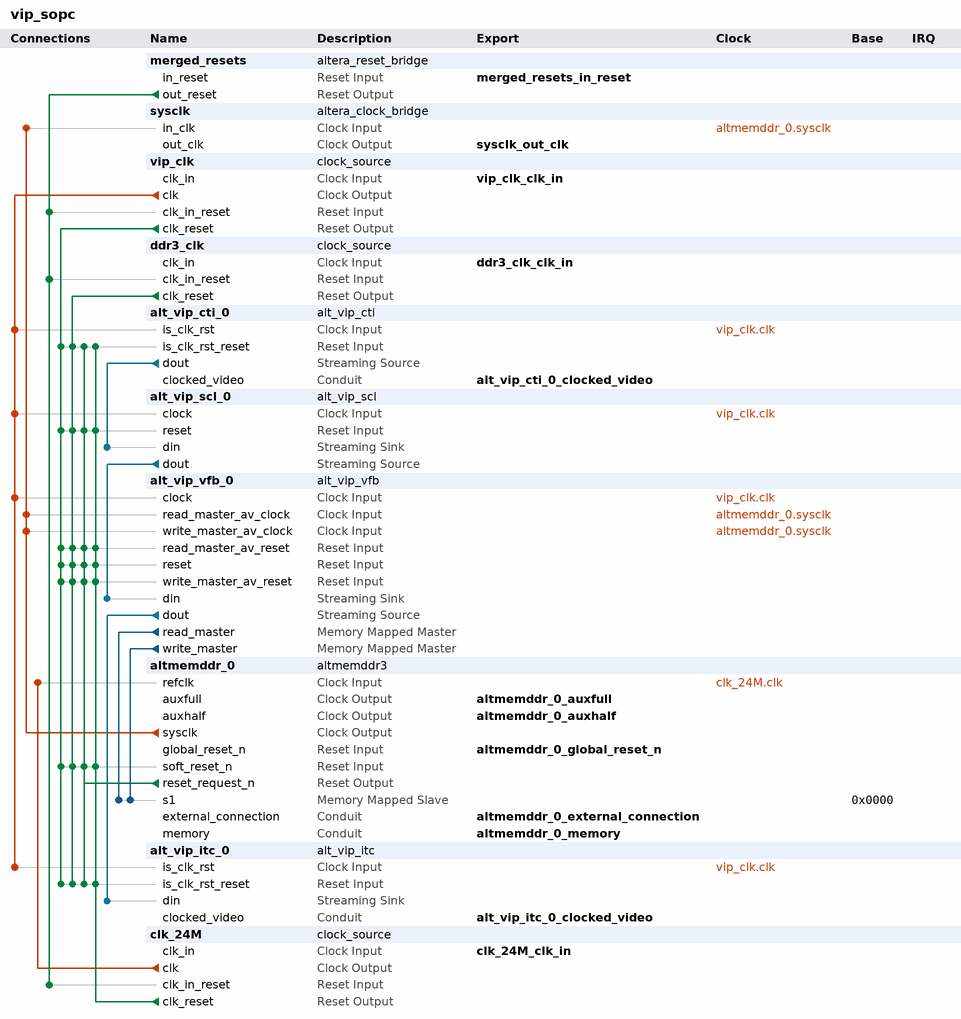
[diagram p0: system contents]
# Platform Designer (Qsys) system vip_sopc
# Parameters at their usual value, and those the tool derives, are not listed.
package require -exact qsys 12.0
create_system vip_sopc
set_project_property DEVICE_FAMILY {Stratix III}

add_instance merged_resets altera_reset_bridge 12.0
set_instance_parameter_value merged_resets ACTIVE_LOW_RESET 1
set_instance_parameter_value merged_resets SYNCHRONOUS_EDGES none

add_instance sysclk altera_clock_bridge 12.0
set_instance_parameter_value sysclk DERIVED_CLOCK_RATE 180000000
set_instance_parameter_value sysclk EXPLICIT_CLOCK_RATE 0

add_instance vip_clk clock_source 12.0
set_instance_parameter_value vip_clk clockFrequency 120000000

add_instance ddr3_clk clock_source 12.0
set_instance_parameter_value ddr3_clk clockFrequency 50000000

add_instance alt_vip_cti_0 alt_vip_cti 12.0
set_instance_parameter_value alt_vip_cti_0 FAMILY {Stratix III}
set_instance_parameter_value alt_vip_cti_0 BPS 8
set_instance_parameter_value alt_vip_cti_0 NUMBER_OF_COLOUR_PLANES 3
set_instance_parameter_value alt_vip_cti_0 COLOUR_PLANES_ARE_IN_PARALLEL 1
set_instance_parameter_value alt_vip_cti_0 SYNC_TO 0
set_instance_parameter_value alt_vip_cti_0 USE_EMBEDDED_SYNCS 0
set_instance_parameter_value alt_vip_cti_0 ADD_DATA_ENABLE_SIGNAL 0
set_instance_parameter_value alt_vip_cti_0 ACCEPT_COLOURS_IN_SEQ 0
set_instance_parameter_value alt_vip_cti_0 USE_STD 0
set_instance_parameter_value alt_vip_cti_0 STD_WIDTH 1
set_instance_parameter_value alt_vip_cti_0 GENERATE_ANC 0
set_instance_parameter_value alt_vip_cti_0 INTERLACED 0
set_instance_parameter_value alt_vip_cti_0 H_ACTIVE_PIXELS_F0 2048
set_instance_parameter_value alt_vip_cti_0 V_ACTIVE_LINES_F0 576
set_instance_parameter_value alt_vip_cti_0 V_ACTIVE_LINES_F1 576
set_instance_parameter_value alt_vip_cti_0 FIFO_DEPTH 4096
set_instance_parameter_value alt_vip_cti_0 CLOCKS_ARE_SAME 0
set_instance_parameter_value alt_vip_cti_0 USE_CONTROL 0
set_instance_parameter_value alt_vip_cti_0 GENERATE_SYNC 0

add_instance alt_vip_scl_0 alt_vip_scl 12.0
set_instance_parameter_value alt_vip_scl_0 CONTROL_DEPTH 29
set_instance_parameter_value alt_vip_scl_0 PARAMETERISATION {<scalerParams><SCL_NAME>scaler</SCL_NAME><SCL_RUNTIME_CONTROL>0</SCL_RUNTIME_CONTROL><SCL_IN_WIDTH>2048</SCL_IN_WIDTH><SCL_IN_HEIGHT>576</SCL_IN_HEIGHT><SCL_OUT_WIDTH>1024</SCL_OUT_WIDTH><SCL_OUT_HEIGHT>768</SCL_OUT_HEIGHT><SCL_BPS>8</SCL_BPS><SCL_CHANNELS_IN_SEQ>1</SCL_CHANNELS_IN_SEQ><SCL_CHANNELS_IN_PAR>3</SCL_CHANNELS_IN_PAR><SCL_ALGORITHM><NAME>BILINEAR</NAME><V><TAPS>4</TAPS><PHASES>16</PHASES></V><H><TAPS>4</TAPS><PHASES>16</PHASES></H></SCL_ALGORITHM><SCL_PRECISION><V><SIGNED>true</SIGNED><INTEGER_BITS>1</INTEGER_BITS><FRACTION_BITS>7</FRACTION_BITS></V><H><SIGNED>true</SIGNED><INTEGER_BITS>1</INTEGER_BITS><FRACTION_BITS>7</FRACTION_BITS><KERNEL_BITS>9</KERNEL_BITS></H></SCL_PRECISION><SCL_COEFFICIENTS><LOAD_AT_RUNTIME>false</LOAD_AT_RUNTIME><ARE_IDENTICAL>0</ARE_IDENTICAL><V><BANKS>2</BANKS><FUNCTION>LANCZOS_2</FUNCTION><SYMMETRIC>0</SYMMETRIC><FILENAME /></V><H><BANKS>2</BANKS><FUNCTION>LANCZOS_2</FUNCTION><SYMMETRIC>0</SYMMETRIC><FILENAME /></H></SCL_COEFFICIENTS></scalerParams>}

add_instance alt_vip_vfb_0 alt_vip_vfb 12.0

add_instance altmemddr_0 altmemddr3 12.0
set_instance_parameter_value altmemddr_0 pipeline_commands false
set_instance_parameter_value altmemddr_0 debug_en false
set_instance_parameter_value altmemddr_0 export_debug_port false
set_instance_parameter_value altmemddr_0 use_generated_memory_model true
set_instance_parameter_value altmemddr_0 dedicated_memory_clk_phase_label {Dedicated memory clock phase:}
set_instance_parameter_value altmemddr_0 mem_if_clk_mhz 360.0
set_instance_parameter_value altmemddr_0 quartus_project_exists false
set_instance_parameter_value altmemddr_0 local_if_drate Half
set_instance_parameter_value altmemddr_0 enable_v72_rsu false
set_instance_parameter_value altmemddr_0 local_if_clk_mhz_label 180.0
set_instance_parameter_value altmemddr_0 new_variant false
set_instance_parameter_value altmemddr_0 mem_if_memtype {DDR3 SDRAM}
set_instance_parameter_value altmemddr_0 pll_ref_clk_mhz 24.0
set_instance_parameter_value altmemddr_0 mem_if_clk_ps_label {(2778 ps)}
set_instance_parameter_value altmemddr_0 family {Stratix III}
set_instance_parameter_value altmemddr_0 project_family {Stratix III}
set_instance_parameter_value altmemddr_0 speed_grade 3
set_instance_parameter_value altmemddr_0 dedicated_memory_clk_phase 0
set_instance_parameter_value altmemddr_0 pll_ref_clk_ps_label {(41667 ps)}
set_instance_parameter_value altmemddr_0 avalon_burst_length 1
set_instance_parameter_value altmemddr_0 mem_if_clk_pair_count 1
set_instance_parameter_value altmemddr_0 mem_if_cs_per_dimm 1
set_instance_parameter_value altmemddr_0 pre_latency_label {Fix read latency at:}
set_instance_parameter_value altmemddr_0 dedicated_memory_clk_en false
set_instance_parameter_value altmemddr_0 mirror_addressing 0
set_instance_parameter_value altmemddr_0 mem_if_bankaddr_width 3
set_instance_parameter_value altmemddr_0 register_control_word_9 0000
set_instance_parameter_value altmemddr_0 mem_if_rowaddr_width 13
set_instance_parameter_value altmemddr_0 mem_dyn_deskew_en false
set_instance_parameter_value altmemddr_0 post_latency_label {cycles (0 cycles=minimum latency, non-deterministic)}
set_instance_parameter_value altmemddr_0 mem_if_dm_pins_en Yes
set_instance_parameter_value altmemddr_0 local_if_dwidth_label 256
set_instance_parameter_value altmemddr_0 register_control_word_7 0000
set_instance_parameter_value altmemddr_0 register_control_word_8 0000
set_instance_parameter_value altmemddr_0 mem_if_preset {Custom (Hynix DDR3-1066 1Gb 2x16)}
set_instance_parameter_value altmemddr_0 mem_if_pchaddr_bit 10
set_instance_parameter_value altmemddr_0 WIDTH_RATIO 4
set_instance_parameter_value altmemddr_0 vendor Hynix
set_instance_parameter_value altmemddr_0 register_control_word_3 0000
set_instance_parameter_value altmemddr_0 register_control_word_4 0000
set_instance_parameter_value altmemddr_0 chip_or_dimm {Unbuffered DIMM}
set_instance_parameter_value altmemddr_0 register_control_word_5 0000
set_instance_parameter_value altmemddr_0 register_control_word_6 0000
set_instance_parameter_value altmemddr_0 mem_fmax 533.333
set_instance_parameter_value altmemddr_0 register_control_word_0 0000
set_instance_parameter_value altmemddr_0 register_control_word_size 4
set_instance_parameter_value altmemddr_0 register_control_word_1 0000
set_instance_parameter_value altmemddr_0 register_control_word_2 0000
set_instance_parameter_value altmemddr_0 register_control_word_11 0000
set_instance_parameter_value altmemddr_0 register_control_word_10 0000
set_instance_parameter_value altmemddr_0 mem_if_cs_width 1
set_instance_parameter_value altmemddr_0 mem_if_preset_rlat 0
set_instance_parameter_value altmemddr_0 mem_if_cs_per_rank 1
set_instance_parameter_value altmemddr_0 fast_simulation_en FAST
set_instance_parameter_value altmemddr_0 register_control_word_15 0000
set_instance_parameter_value altmemddr_0 register_control_word_14 0000
set_instance_parameter_value altmemddr_0 mem_if_dwidth 64
set_instance_parameter_value altmemddr_0 mem_if_dq_per_dqs 8
set_instance_parameter_value altmemddr_0 mem_if_coladdr_width 10
set_instance_parameter_value altmemddr_0 register_control_word_13 0000
set_instance_parameter_value altmemddr_0 register_control_word_12 0000
set_instance_parameter_value altmemddr_0 mem_tiha_ps 300
set_instance_parameter_value altmemddr_0 mem_tdsh_ck 0.2
set_instance_parameter_value altmemddr_0 mem_if_trfc_ns 110.0
set_instance_parameter_value altmemddr_0 mem_tqh_ck 0.38
set_instance_parameter_value altmemddr_0 mem_tisa_ps 300
set_instance_parameter_value altmemddr_0 mem_tdss_ck 0.2
set_instance_parameter_value altmemddr_0 mem_trtp_ns 13.2
set_instance_parameter_value altmemddr_0 mem_if_tinit_us 500.0
set_instance_parameter_value altmemddr_0 mem_if_trcd_ns 15.0
set_instance_parameter_value altmemddr_0 mem_if_twtr_ck 4
set_instance_parameter_value altmemddr_0 mem_trrd_ns 10.0
set_instance_parameter_value altmemddr_0 mem_tdqss_ck 0.25
set_instance_parameter_value altmemddr_0 mem_tqhs_ps 300
set_instance_parameter_value altmemddr_0 mem_tdsa_ps 200
set_instance_parameter_value altmemddr_0 mem_tac_ps 400
set_instance_parameter_value altmemddr_0 mem_tdha_ps 200
set_instance_parameter_value altmemddr_0 mem_if_tras_ns 37.5
set_instance_parameter_value altmemddr_0 mem_if_twr_ns 15.0
set_instance_parameter_value altmemddr_0 mem_tdqsck_ps 400
set_instance_parameter_value altmemddr_0 mem_if_trp_ns 15.0
set_instance_parameter_value altmemddr_0 mem_tdqsq_ps 150
set_instance_parameter_value altmemddr_0 mem_if_tmrd_ns 10.0
set_instance_parameter_value altmemddr_0 mem_tfaw_ns 40.0
set_instance_parameter_value altmemddr_0 mem_if_trefi_us 7.8
set_instance_parameter_value altmemddr_0 mem_tcl_40_fmax 533.0
set_instance_parameter_value altmemddr_0 mem_odt Disabled
set_instance_parameter_value altmemddr_0 mp_WLH_percent 0.6
set_instance_parameter_value altmemddr_0 mem_drv_str Normal
set_instance_parameter_value altmemddr_0 mp_DH_percent 0.5
set_instance_parameter_value altmemddr_0 input_period 0
set_instance_parameter_value altmemddr_0 mp_QH_percent 0.5
set_instance_parameter_value altmemddr_0 mp_QHS_percent 0.5
set_instance_parameter_value altmemddr_0 mem_tcl_30_fmax 533.0
set_instance_parameter_value altmemddr_0 ac_clk_select dedicated
set_instance_parameter_value altmemddr_0 mp_DQSQ_percent 0.65
set_instance_parameter_value altmemddr_0 mp_DS_percent 0.6
set_instance_parameter_value altmemddr_0 pll_reconfig_ports_en false
set_instance_parameter_value altmemddr_0 mem_btype Sequential
set_instance_parameter_value altmemddr_0 mp_IS_percent 0.7
set_instance_parameter_value altmemddr_0 mem_tcl 6.0
set_instance_parameter_value altmemddr_0 mp_DQSS_percent 0.5
set_instance_parameter_value altmemddr_0 export_bank_info false
set_instance_parameter_value altmemddr_0 mp_DSS_percent 0.6
set_instance_parameter_value altmemddr_0 mem_dll_en Yes
set_instance_parameter_value altmemddr_0 ac_phase 240
set_instance_parameter_value altmemddr_0 mem_if_oct_en false
set_instance_parameter_value altmemddr_0 mem_tcl_60_fmax 533.333
set_instance_parameter_value altmemddr_0 mp_DSH_percent 0.6
set_instance_parameter_value altmemddr_0 mem_if_dqsn_en true
set_instance_parameter_value altmemddr_0 enable_mp_calibration true
set_instance_parameter_value altmemddr_0 mp_IH_percent 0.6
set_instance_parameter_value altmemddr_0 mem_tcl_15_fmax 533.0
set_instance_parameter_value altmemddr_0 dll_external false
set_instance_parameter_value altmemddr_0 mem_bl {On the fly}
set_instance_parameter_value altmemddr_0 mp_WLS_percent 0.7
set_instance_parameter_value altmemddr_0 mem_tcl_50_fmax 400.0
set_instance_parameter_value altmemddr_0 mp_DQSCK_percent 0.5
set_instance_parameter_value altmemddr_0 mem_tcl_25_fmax 533.0
set_instance_parameter_value altmemddr_0 mem_tcl_20_fmax 533.0
set_instance_parameter_value altmemddr_0 cfg_reorder_data false
set_instance_parameter_value altmemddr_0 ctl_ecc_en false
set_instance_parameter_value altmemddr_0 ctl_hrb_en false
set_instance_parameter_value altmemddr_0 ref_clk_source clk_24M
set_instance_parameter_value altmemddr_0 cfg_data_reordering_type INTER_BANK
set_instance_parameter_value altmemddr_0 ctl_powerdn_en false
set_instance_parameter_value altmemddr_0 multicast_wr_en false
set_instance_parameter_value altmemddr_0 auto_powerdn_cycles 0
set_instance_parameter_value altmemddr_0 ctl_self_refresh_en false
set_instance_parameter_value altmemddr_0 cfg_starve_limit 10
set_instance_parameter_value altmemddr_0 ctl_latency 0
set_instance_parameter_value altmemddr_0 tool_context SOPC_BUILDER
set_instance_parameter_value altmemddr_0 mem_addr_mapping CHIP_ROW_BANK_COL
set_instance_parameter_value altmemddr_0 burst_merge_en false
set_instance_parameter_value altmemddr_0 user_refresh_en false
set_instance_parameter_value altmemddr_0 qsys_mode true
set_instance_parameter_value altmemddr_0 clk_source_sharing_en false
set_instance_parameter_value altmemddr_0 ctl_lookahead_depth 4
set_instance_parameter_value altmemddr_0 ctl_autopch_en false
set_instance_parameter_value altmemddr_0 ctl_dynamic_bank_allocation false
set_instance_parameter_value altmemddr_0 ctl_dynamic_bank_num 4
set_instance_parameter_value altmemddr_0 local_if_type_avalon true
set_instance_parameter_value altmemddr_0 csr_en false
set_instance_parameter_value altmemddr_0 ctl_auto_correct_en false
set_instance_parameter_value altmemddr_0 auto_powerdn_en false
set_instance_parameter_value altmemddr_0 phy_if_type_afi true
set_instance_parameter_value altmemddr_0 controller_type ddrx_ctl
set_instance_parameter_value altmemddr_0 max_local_size 4
set_instance_parameter_value altmemddr_0 mem_srtr Normal
set_instance_parameter_value altmemddr_0 mem_mpr_loc {Predefined Pattern}
set_instance_parameter_value altmemddr_0 dss_tinit_rst_us 200.0
set_instance_parameter_value altmemddr_0 mem_tcl_90_fmax 80.0
set_instance_parameter_value altmemddr_0 mem_rtt_wr {Dynamic ODT off}
set_instance_parameter_value altmemddr_0 mem_tcl_100_fmax 80.0
set_instance_parameter_value altmemddr_0 mem_pasr {Full Array}
set_instance_parameter_value altmemddr_0 mem_asrm {Manual SR Reference (SRT)}
set_instance_parameter_value altmemddr_0 mem_mpr_oper {Predefined Pattern}
set_instance_parameter_value altmemddr_0 mem_tcl_80_fmax 533.333
set_instance_parameter_value altmemddr_0 mem_drv_impedance RZQ/7
set_instance_parameter_value altmemddr_0 mem_rtt_nom RZQ/4
set_instance_parameter_value altmemddr_0 mem_tcl_70_fmax 533.333
set_instance_parameter_value altmemddr_0 mem_wtcl 6.0
set_instance_parameter_value altmemddr_0 mem_dll_pch {Fast exit}
set_instance_parameter_value altmemddr_0 mem_atcl Disabled
set_instance_parameter_value altmemddr_0 board_settings_valid true
set_instance_parameter_value altmemddr_0 t_IH 0.3
set_instance_parameter_value altmemddr_0 board_intra_DQS_group_skew 0.02
set_instance_parameter_value altmemddr_0 isi_DQS 0.0
set_instance_parameter_value altmemddr_0 addr_cmd_slew_rate 1.0
set_instance_parameter_value altmemddr_0 board_tpd_inter_DIMM 0.05
set_instance_parameter_value altmemddr_0 board_addresscmd_CK_skew 0.0
set_instance_parameter_value altmemddr_0 t_DS_calculated 0.200
set_instance_parameter_value altmemddr_0 isi_addresscmd_hold 0.0
set_instance_parameter_value altmemddr_0 t_IS 0.3
set_instance_parameter_value altmemddr_0 restore_default_toggle false
set_instance_parameter_value altmemddr_0 dqs_dqsn_slew_rate 2.0
set_instance_parameter_value altmemddr_0 dq_slew_rate 1.0
set_instance_parameter_value altmemddr_0 board_inter_DQS_group_skew 0.02
set_instance_parameter_value altmemddr_0 isi_addresscmd_setup 0.0
set_instance_parameter_value altmemddr_0 board_minCK_DQS_skew -0.01
set_instance_parameter_value altmemddr_0 t_IS_calculated 0.300
set_instance_parameter_value altmemddr_0 num_slots_or_devices 1
set_instance_parameter_value altmemddr_0 board_maxCK_DQS_skew 0.01
set_instance_parameter_value altmemddr_0 board_skew_ps 20
set_instance_parameter_value altmemddr_0 t_DH 0.2
set_instance_parameter_value altmemddr_0 ck_ckn_slew_rate 2.0
set_instance_parameter_value altmemddr_0 isi_DQ 0.0
set_instance_parameter_value altmemddr_0 t_IH_calculated 0.300
set_instance_parameter_value altmemddr_0 t_DH_calculated 0.200
set_instance_parameter_value altmemddr_0 t_DS 0.2

add_instance alt_vip_itc_0 alt_vip_itc 12.0
set_instance_parameter_value alt_vip_itc_0 NUMBER_OF_COLOUR_PLANES 3
set_instance_parameter_value alt_vip_itc_0 H_ACTIVE_PIXELS 1024
set_instance_parameter_value alt_vip_itc_0 V_ACTIVE_LINES 768
set_instance_parameter_value alt_vip_itc_0 FIFO_DEPTH 2048
set_instance_parameter_value alt_vip_itc_0 THRESHOLD 1024
set_instance_parameter_value alt_vip_itc_0 AP_LINE 3
set_instance_parameter_value alt_vip_itc_0 H_SYNC_LENGTH 136
set_instance_parameter_value alt_vip_itc_0 H_FRONT_PORCH 24
set_instance_parameter_value alt_vip_itc_0 H_BACK_PORCH 160
set_instance_parameter_value alt_vip_itc_0 V_SYNC_LENGTH 6
set_instance_parameter_value alt_vip_itc_0 V_FRONT_PORCH 3
set_instance_parameter_value alt_vip_itc_0 V_BACK_PORCH 29

add_instance clk_24M clock_source 12.0
set_instance_parameter_value clk_24M clockFrequency 24000000

# connections
add_connection altmemddr_0.sysclk alt_vip_vfb_0.read_master_av_clock clock
add_connection altmemddr_0.sysclk alt_vip_vfb_0.write_master_av_clock clock
add_connection altmemddr_0.sysclk sysclk.in_clk clock
add_connection clk_24M.clk altmemddr_0.refclk clock
add_connection vip_clk.clk alt_vip_cti_0.is_clk_rst clock
add_connection vip_clk.clk alt_vip_itc_0.is_clk_rst clock
add_connection vip_clk.clk alt_vip_scl_0.clock clock
add_connection vip_clk.clk alt_vip_vfb_0.clock clock
add_connection altmemddr_0.reset_request_n alt_vip_cti_0.is_clk_rst_reset reset
add_connection altmemddr_0.reset_request_n alt_vip_itc_0.is_clk_rst_reset reset
add_connection altmemddr_0.reset_request_n alt_vip_scl_0.reset reset
add_connection altmemddr_0.reset_request_n alt_vip_vfb_0.read_master_av_reset reset
add_connection altmemddr_0.reset_request_n alt_vip_vfb_0.reset reset
add_connection altmemddr_0.reset_request_n alt_vip_vfb_0.write_master_av_reset reset
add_connection altmemddr_0.reset_request_n altmemddr_0.soft_reset_n reset
add_connection clk_24M.clk_reset alt_vip_cti_0.is_clk_rst_reset reset
add_connection clk_24M.clk_reset alt_vip_itc_0.is_clk_rst_reset reset
add_connection clk_24M.clk_reset alt_vip_scl_0.reset reset
add_connection clk_24M.clk_reset alt_vip_vfb_0.read_master_av_reset reset
add_connection clk_24M.clk_reset alt_vip_vfb_0.reset reset
add_connection clk_24M.clk_reset alt_vip_vfb_0.write_master_av_reset reset
add_connection clk_24M.clk_reset altmemddr_0.soft_reset_n reset
add_connection ddr3_clk.clk_reset alt_vip_cti_0.is_clk_rst_reset reset
add_connection ddr3_clk.clk_reset alt_vip_itc_0.is_clk_rst_reset reset
add_connection ddr3_clk.clk_reset alt_vip_scl_0.reset reset
add_connection ddr3_clk.clk_reset alt_vip_vfb_0.read_master_av_reset reset
add_connection ddr3_clk.clk_reset alt_vip_vfb_0.reset reset
add_connection ddr3_clk.clk_reset alt_vip_vfb_0.write_master_av_reset reset
add_connection ddr3_clk.clk_reset altmemddr_0.soft_reset_n reset
add_connection merged_resets.out_reset clk_24M.clk_in_reset reset
add_connection merged_resets.out_reset ddr3_clk.clk_in_reset reset
add_connection merged_resets.out_reset vip_clk.clk_in_reset reset
add_connection vip_clk.clk_reset alt_vip_cti_0.is_clk_rst_reset reset
add_connection vip_clk.clk_reset alt_vip_itc_0.is_clk_rst_reset reset
add_connection vip_clk.clk_reset alt_vip_scl_0.reset reset
add_connection vip_clk.clk_reset alt_vip_vfb_0.read_master_av_reset reset
add_connection vip_clk.clk_reset alt_vip_vfb_0.reset reset
add_connection vip_clk.clk_reset alt_vip_vfb_0.write_master_av_reset reset
add_connection vip_clk.clk_reset altmemddr_0.soft_reset_n reset
add_connection alt_vip_vfb_0.read_master altmemddr_0.s1 avalon
set_connection_parameter_value alt_vip_vfb_0.read_master/altmemddr_0.s1 baseAddress 0x0000
add_connection alt_vip_vfb_0.write_master altmemddr_0.s1 avalon
set_connection_parameter_value alt_vip_vfb_0.write_master/altmemddr_0.s1 baseAddress 0x0000
add_connection alt_vip_vfb_0.write_master altmemddr_0.s1 avalon
set_connection_parameter_value alt_vip_vfb_0.write_master/altmemddr_0.s1 baseAddress 0x0000
add_connection alt_vip_cti_0.dout alt_vip_scl_0.din avalon_streaming
add_connection alt_vip_scl_0.dout alt_vip_vfb_0.din avalon_streaming
add_connection alt_vip_vfb_0.dout alt_vip_itc_0.din avalon_streaming

# exported interfaces
add_interface alt_vip_itc_0_clocked_video conduit end
set_interface_property alt_vip_itc_0_clocked_video EXPORT_OF alt_vip_itc_0.clocked_video
add_interface altmemddr_0_auxfull clock source
set_interface_property altmemddr_0_auxfull EXPORT_OF altmemddr_0.auxfull
add_interface clk_24M_clk_in clock sink
set_interface_property clk_24M_clk_in EXPORT_OF clk_24M.clk_in
add_interface altmemddr_0_external_connection conduit end
set_interface_property altmemddr_0_external_connection EXPORT_OF altmemddr_0.external_connection
add_interface altmemddr_0_memory conduit end
set_interface_property altmemddr_0_memory EXPORT_OF altmemddr_0.memory
add_interface vip_clk_clk_in clock sink
set_interface_property vip_clk_clk_in EXPORT_OF vip_clk.clk_in
add_interface altmemddr_0_global_reset_n reset sink
set_interface_property altmemddr_0_global_reset_n EXPORT_OF altmemddr_0.global_reset_n
add_interface ddr3_clk_clk_in clock sink
set_interface_property ddr3_clk_clk_in EXPORT_OF ddr3_clk.clk_in
add_interface sysclk_out_clk clock source
set_interface_property sysclk_out_clk EXPORT_OF sysclk.out_clk
add_interface altmemddr_0_auxhalf clock source
set_interface_property altmemddr_0_auxhalf EXPORT_OF altmemddr_0.auxhalf
add_interface merged_resets_in_reset reset sink
set_interface_property merged_resets_in_reset EXPORT_OF merged_resets.in_reset
add_interface alt_vip_cti_0_clocked_video conduit end
set_interface_property alt_vip_cti_0_clocked_video EXPORT_OF alt_vip_cti_0.clocked_video

save_system vip_sopc.qsys
